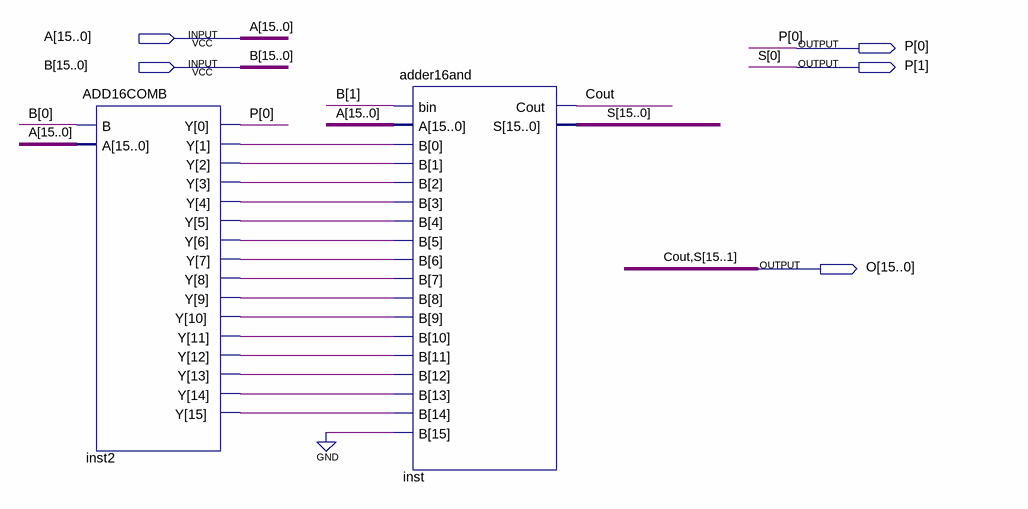
[diagram p0: schematic sheet]
// Quartus schematic MULTIPp1.bdf as structural Verilog: 2 symbols, 5 pins
module MULTIPp1 (
  input  [15:0] A,
  input  [15:0] B,
  output [1:0] P,
  output [15:0] O
);

  wire inst2_y, inst2_y_2, inst2_y_3, inst2_y_4, inst2_y_5, inst2_y_6, inst2_y_7, inst2_y_8, inst2_y_9,
       inst2_y_10, inst2_y_11, inst2_y_12, inst2_y_13, inst2_y_14, inst2_y_15;

  ADD16COMB inst2 (
    .B(B[0]), .A(A),
    .Y({inst2_y_15, inst2_y_14, inst2_y_13, inst2_y_12, inst2_y_11, inst2_y_10, inst2_y_9, inst2_y_8, inst2_y_7, inst2_y_6, inst2_y_5, inst2_y_4, inst2_y_3, inst2_y_2, inst2_y, P[0]}));
  adder16and inst (
    .bin(B[1]), .A(A),
    .B({1'b0, inst2_y_15, inst2_y_14, inst2_y_13, inst2_y_12, inst2_y_11, inst2_y_10, inst2_y_9, inst2_y_8, inst2_y_7, inst2_y_6, inst2_y_5, inst2_y_4, inst2_y_3, inst2_y_2, inst2_y}),
    .Cout(O[15]), .S({O[14:0], P[1]}));

  // Other names for the same wires on the sheet: Cout = O[15]; S[15:0] = {O[14:0], P[1]}
endmodule
